# Altium project MSXII_SolarSenseMaster.PrjPcb
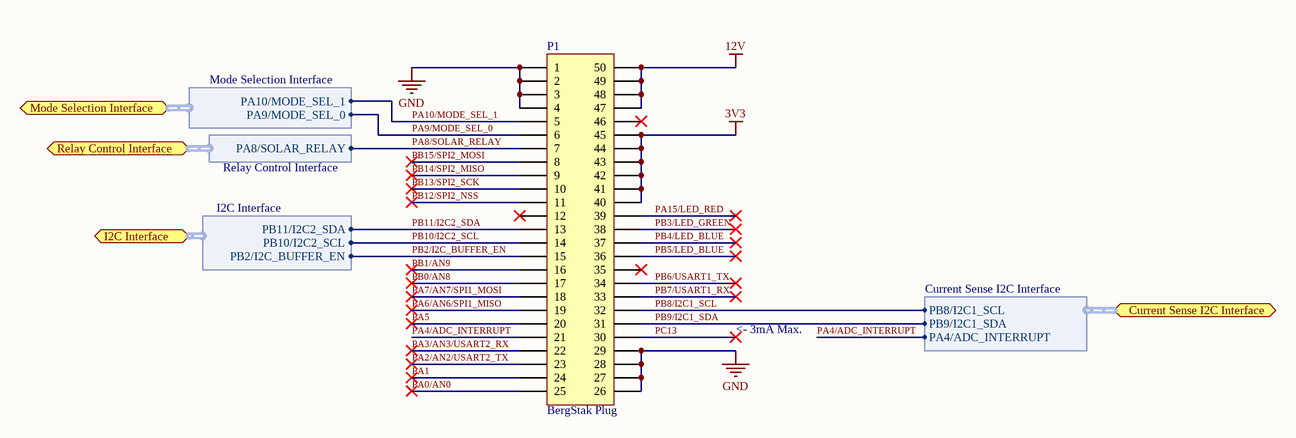
[diagram p0: Controller_Board_Interface.SchDoc]
ProjectAuthor: Peiliang Guo; ProjectRevision: 1.0
3 sheets, 62 parts. Net scope: flat (ports and power ports of the same name join across sheets).
Board file: SolarSenseMaster.PcbDoc
Sheets:
  Controller_Board_Interface.SchDoc
  SolarSenseMaster.SchDoc
  I2C_Interface.SchDoc

## Sheet Controller_Board_Interface.SchDoc
size Letter; Organization: Midnight Sun Solar Rayce Car Team; Address1: University of Waterloo; Address2: 200 University Ave W; Address3: Waterloo, ON, Canada; Address4: N2L 3E9; Website: www.uwmidsun.com

### Parts
P1  Series: BergStak Plug  [CONN, Bergstak 50 Pos Plug]  (hidden comment: CONN 50POS Bergstak Plug 0.02")

### Ports
Current Sense I2C Interface (harness Current Sense I2C Interface), I2C Interface (harness I2C Interface), Mode Selection Interface (harness Mode Selection Interface), Relay Control Interface (harness Relay Control Interface)

### Harnesses
I2C Interface: PB10/I2C2_SCL, PB11/I2C2_SDA, PB2/I2C_BUFFER_EN
Relay Control Interface: PA8/SOLAR_RELAY
Current Sense I2C Interface: PB8/I2C1_SCL, PB9/I2C1_SDA, PA4/ADC_INTERRUPT
Mode Selection Interface: PA9/MODE_SEL_0, PA10/MODE_SEL_1

### Nets
3V3: P1.40 P1.41 P1.42 P1.43 P1.44 P1.45
12V: P1.47 P1.48 P1.49 P1.50
GND: P1.1 P1.2 P1.3 P1.4 P1.26 P1.27 P1.28 P1.29
PA0/AN0: P1.25
PA1: P1.24
PA2/AN2/USART2_TX: P1.23
PA3/AN3/USART2_RX: P1.22
PA4/ADC_INTERRUPT: P1.21 ; port Current Sense I2C Interface.PA4/ADC_INTERRUPT
PA5: P1.20
PA6/AN6/SPI1_MISO: P1.19
PA7/AN7/SPI1_MOSI: P1.18
PA8/SOLAR_RELAY: P1.7 ; port Relay Control Interface.PA8/SOLAR_RELAY
PA9/MODE_SEL_0: P1.6 ; port Mode Selection Interface.PA9/MODE_SEL_0
PA10/MODE_SEL_1: P1.5 ; port Mode Selection Interface.PA10/MODE_SEL_1
PA15/LED_RED: P1.39
PB0/AN8: P1.17
PB1/AN9: P1.16
PB2/I2C_BUFFER_EN: P1.15 ; port I2C Interface.PB2/I2C_BUFFER_EN
PB3/LED_GREEN: P1.38
PB4/LED_BLUE: P1.37
PB5/LED_BLUE: P1.36
PB6/USART1_TX: P1.34
PB7/USART1_RX: P1.33
PB8/I2C1_SCL: P1.32 ; port Current Sense I2C Interface.PB8/I2C1_SCL
PB9/I2C1_SDA: P1.31 ; port Current Sense I2C Interface.PB9/I2C1_SDA
PB10/I2C2_SCL: P1.14 ; port I2C Interface.PB10/I2C2_SCL
PB11/I2C2_SDA: P1.13 ; port I2C Interface.PB11/I2C2_SDA
PB12/SPI2_NSS: P1.11
PB13/SPI2_SCK: P1.10
PB14/SPI2_MISO: P1.9
PB15/SPI2_MOSI: P1.8
PC13: P1.30

Not connected (* = marked no-connect by the designer): P1 12* 35* 46*

### Notes on the sheet
- <- 3mA Max.
- Project:
- Title:
- Size:
- Project Author
- Letter
- Revision:
- University of Waterloo
- 200 University Ave W
- Waterloo, ON, Canada
- N2L 3E9
- Date:
- Sheet
- of
- Website:

### Library data of the parts
P1 = CONN 50POS Bergstak Plug 0.02": 50 Position Connector Plug, Outer Shroud Contacts Surface Mount Gold; Manufacturer 1: Amphenol FCI; Manufacturer Part Number 1: 10132797-055100LF; Number of Positions: 50; Mated Stacking Heights: 5mm; Pitch: 0.020" (0.50mm); Supplier 1: Digi-Key; Supplier Part Number 1: 609-5226-1-ND; Packaging: Cut Tape (CT); Part Status: Active; Connector Type: Plug, Outer Shroud Contacts; Number of Rows: 2; Mounting Type: Surface Mount; Contact Finish: Gold; Contact Finish Thickness: 1µin (0.025µm); Height Above Board: 0.169" (4.30mm); ComponentLink1URL: http://portal.fciconnect.com/Comergent//fci/drawing/10132797.pdf; ComponentLink1Description: http://portal.fciconnect.com/Comergent//fci/drawing/10132797.pdf

## Sheet SolarSenseMaster.SchDoc
size Letter; Organization: Midnight Sun Solar Rayce Car Team; Address1: University of Waterloo; Address2: 200 University Ave W; Address3: Waterloo, ON, Canada; Address4: N2L 3E9; Website: www.uwmidsun.com
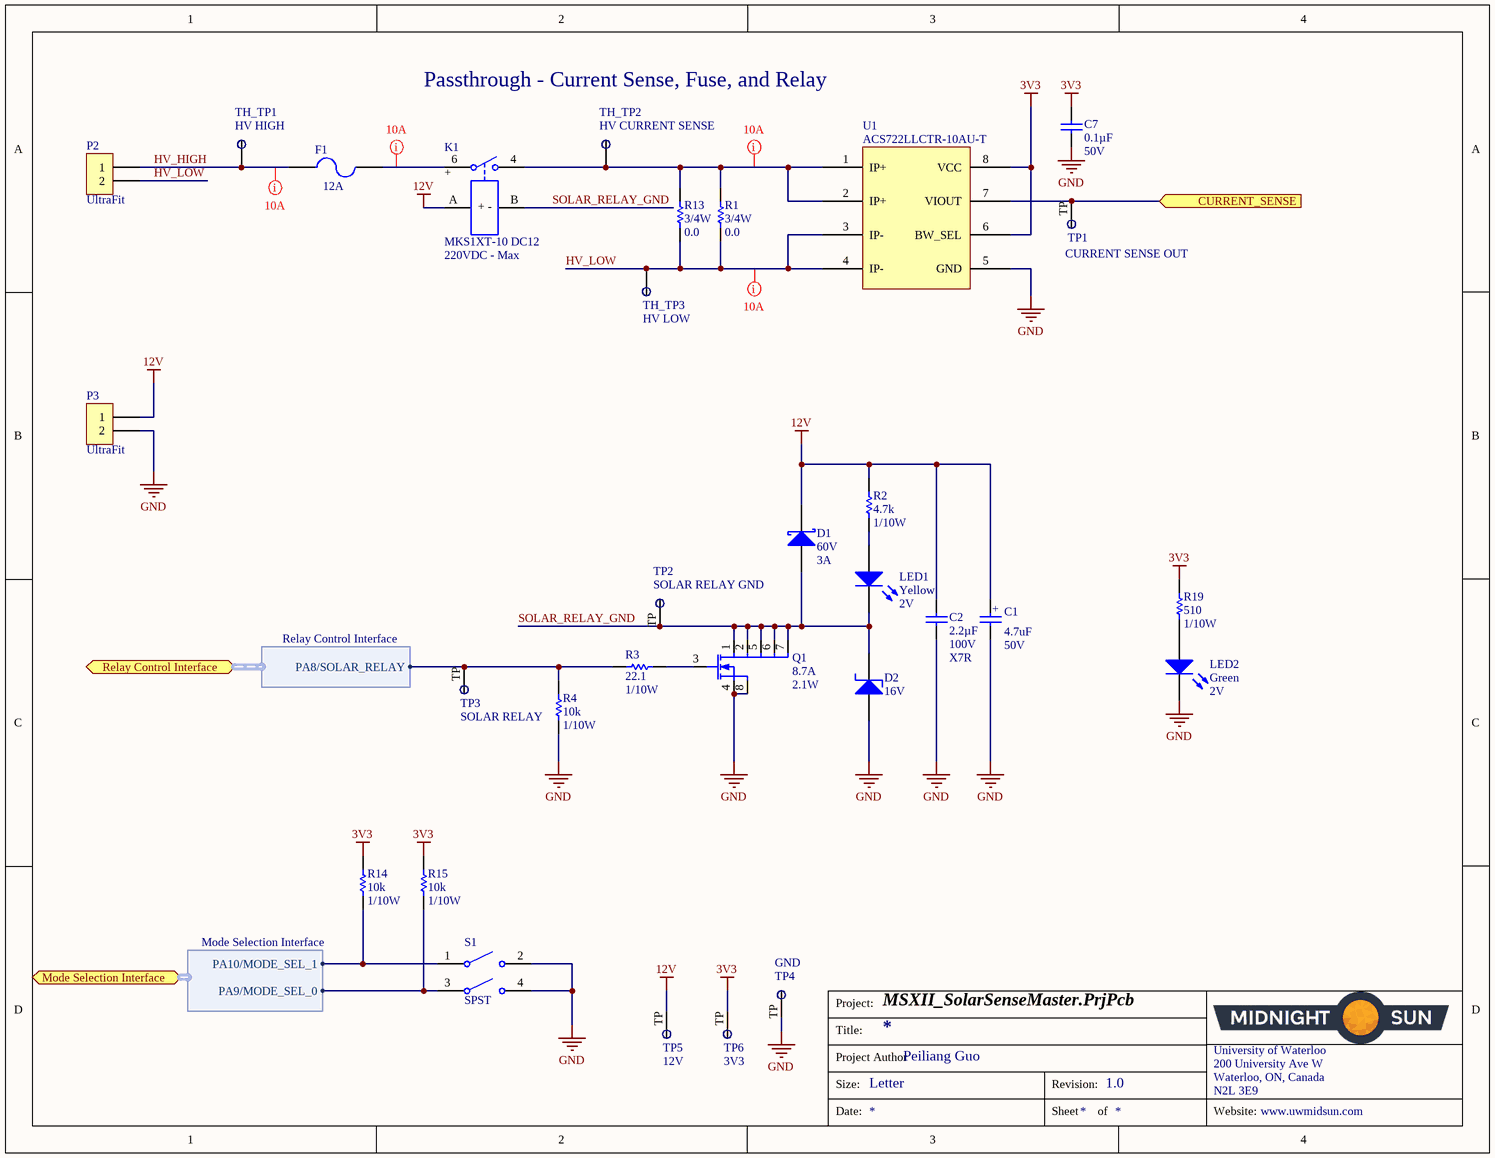
[diagram p1: SolarSenseMaster.SchDoc]

### Parts
C1  Capacitance: 4.7uF  Voltage Rating (DC): 50V  [CAP ALUM 6.3MM RADIAL SMD]  (hidden comment: EEE-1HA4R7NP)
C2  Capacitance: 2.2µF  Voltage: 100V  Temperature Coefficient: X7R  [CAP, 1206]  (hidden comment: CAP CER 2.2UF 100V ±20% X7R 1206)
C7  Capacitance: 0.1µF  Voltage: 50V  [CAP, 0603]  (hidden comment: CAP CER 0.1UF 50V 10% X7R 0603)
D1  Voltage - DC Reverse (Vr) (Max): 60V  Current - Average Rectified (Io): 3A  [Diode, SMA]  (hidden comment: DIODE SCHOTTKY 60V 3A SMA)
D2  Voltage - Zener (Nom): 16V  [DO-214AA Diode]  (hidden comment: DIODE ZENER 16V 5W DO-214AA (SMB))
F1  Current Rating: 12A  [FUSE CLIPS 1A3400-09-R]  (hidden comment: FUSE 12 A 600VAC/DC KLM-12)
K1  Manufacturer Part Number: MKS1XT-10 DC12  Switching Voltage: 220VDC - Max  [RELAY SOCKET P7M-06P]  (hidden comment: RELAY SPST 12V 10A)
LED1  Color: Yellow  Voltage - Forward (Vf) (Typ): 2V  [LED_0603]  (hidden comment: LED YELLOW CLEAR 2.1V 0603)
LED2  Color: Green  Voltage - Forward (Vf) (Typ): 2V  [LED_0603]  (hidden comment: LED GREEN CLEAR 2V 0603)
P2  Series: UltraFit  [CONN, 2POS ULTRA-FIT]  (hidden comment: CONN 2POS ULTRA-FIT 0.138")
P3  Series: UltraFit  [CONN, 2POS ULTRA-FIT]  (hidden comment: CONN 2POS ULTRA-FIT 0.138")
Q1  Current - Continuous Drain (Id) @ 25°C: 8.7A  Power Dissipation (Max): 2.1W  [MOSFET N-CH 30V 12A 2mmx2mm PQFN]  (hidden comment: MOSFET N-CH 30V 8.7A 2.1W 6-PQFN (2x2))
R1  Power (Watts): 3/4W  Resistance: 0.0  [RES 1206]  (hidden comment: RES 0.0 OHM 3/4W 1206)
R2  Resistance (Ohms): 4.7k  Power (Watts): 1/10W  [RES, 0603]  (hidden comment: RES 4.7K OHM 1% 1/10W 0603)
R3  Resistance: 22.1  Power: 1/10W  [RES, 0603]  (hidden comment: RES 22.1 OHM 1% 1/10W 0603)
R4  Resistance: 10k  Power: 1/10W  [RES, 0603]  (hidden comment: RES 10K OHM 1% 1/10W 0603)
R13  Power (Watts): 3/4W  Resistance: 0.0  [RES 1206]  (hidden comment: RES 0.0 OHM 3/4W 1206)
R14  Resistance: 10k  Power: 1/10W  [RES, 0603]  (hidden comment: RES 10K OHM 1% 1/10W 0603)
R15  Resistance: 10k  Power: 1/10W  [RES, 0603]  (hidden comment: RES 10K OHM 1% 1/10W 0603)
R19  Resistance: 510  Power: 1/10W  [RES, 0603]  (hidden comment: RES 510 OHM 5% 1/10W 0603)
S1  SPST  [SW SPST 2POS DIP 0.1A 20V]
TH_TP1  HV HIGH  [Thru Test Point]
TH_TP2  HV CURRENT SENSE  [Thru Test Point]
TH_TP3  HV LOW  [Thru Test Point]
TP1  CURRENT SENSE OUT  [Test Point]  (no BOM)
TP2  SOLAR RELAY GND  [Test Point]  (no BOM)
TP3  SOLAR RELAY  [Test Point]  (no BOM)
TP4  GND  [Test Point]  (no BOM)
TP5  12V  [Test Point]  (no BOM)
TP6  3V3  [Test Point]  (no BOM)
U1  Manufacturer Part Number: ACS722LLCTR-10AU-T  [SOIC8]  (hidden comment: IC CURRENT SENSOR HALL EFFECT 8-SOIC)

### Ports
CURRENT_SENSE (in), Mode Selection Interface (harness Mode Selection Interface), Relay Control Interface (harness Relay Control Interface)

### Harnesses
Relay Control Interface: PA8/SOLAR_RELAY
Mode Selection Interface: PA9/MODE_SEL_0, PA10/MODE_SEL_1

### Nets
3V3: C7.1 R14.1 R15.1 R19.1 TP6.TP U1.6(BW_SEL) U1.8(VCC)
12V: C1.1 C2.1 D1.2 K1.A(+) P3.1 R2.1 TP5.TP
GND: C1.2 C2.2 C7.2 D2.1(A) LED2.2(K) P3.2 Q1.4(S) Q1.8(S) R4.2 S1.2 S1.4 TP4.TP U1.5(GND)
HV_HIGH: F1.1 P2.1 TH_TP1.TH_TP
HV_LOW: P2.2 R1.2 R13.2 TH_TP3.TH_TP U1.3(IP-) U1.4(IP-)
PA8/SOLAR_RELAY: R3.1 R4.1 TP3.TP ; port Relay Control Interface.PA8/SOLAR_RELAY
PA9/MODE_SEL_0: R15.2 S1.3 ; port Mode Selection Interface.PA9/MODE_SEL_0
PA10/MODE_SEL_1: R14.2 S1.1 ; port Mode Selection Interface.PA10/MODE_SEL_1
SOLAR_RELAY_GND: D1.1 D2.2(K) K1.B(-) LED1.2(K) Q1.1(D) Q1.2(D) Q1.5(D) Q1.6(D) Q1.7(D) TP2.TP
NetF1_2: F1.2 K1.6
NetK1_4: K1.4 R1.1 R13.1 TH_TP2.TH_TP U1.1(IP+) U1.2(IP+)
NetLED1_1: LED1.1(A) R2.2
NetLED2_1: LED2.1(A) R19.2
NetQ1_3: Q1.3(G) R3.2
NetR18_1: TP1.TP U1.7(VIOUT) ; port CURRENT_SENSE

### Layout directives
net class 10A: HV_HIGH, HV_LOW, NetF1_2, NetK1_4

### Notes on the sheet
- Passthrough - Current Sense, Fuse, and Relay
- Project:
- Title:
- Size:
- Project Author
- Letter
- Revision:
- University of Waterloo
- 200 University Ave W
- Waterloo, ON, Canada
- N2L 3E9
- Date:
- Sheet
- of
- Website:
- (in symbol CAP ALUM 4.7UF 20% 50V SMD) +
- (in symbol RELAY SPST 12V 10A) + -

### Library data of the parts
C1 = CAP ALUM 4.7UF 20% 50V SMD: 4.7µF 50V Aluminum Electrolytic Capacitors Radial, Can - SMD 2000 Hrs @ 85°C; Manufacturer 1: Panasonic; Description 1: CAPACITOR ALUM ELEC, 4.7UF, 50V, 20%, SMD; Ripple Current: 31mA; Tolerance: 20%; Life (Hours): 2000Hour; Supplier 1: Digi-Key; Supplier Part Number 1: PCE4304CT-ND; Manufacturer Part Number 1: EEE-1HA4R7NP; Stock 1: 19771; Pricing 1: 1=0.43, 10=0.302, 100=0.1986, 500=0.1471 (USD); Mount: Surface Mount,PCB; Case/Package: Radial; Min Operating Temperature: -40°C; Max Operating Temperature: 85°C; Voltage Rating: 50V; Ripple Current (AC): 31mA; Packaging: Tape and Reel; Package Quantity: 1; Termination: SMD/SMT; Diameter: 6.3mm; Length: 5.5mm; Height: 5.4mm; Height - Seated (Max): 0.213inch; Width: 650um; Radiation Hardening: No; REACH SVHC: No SVHC; Lead Free: Lead Free; ComponentLink1URL: https://datasheet.ciiva.com/46374/aba0000ce2-46374373.pdf; ComponentLink1Description: https://datasheet.ciiva.com/46374/aba0000ce2-46374373.pdf; ComponentLink2URL: https://datasheet.ciiva.com/14600/70255710-14600343.pdf; ComponentLink2Description: https://datasheet.ciiva.com/14600/70255710-14600343.pdf; ComponentLink3URL: https://datasheet.ciiva.com/17536/aba0000ce2-17536647.pdf; ComponentLink3Description: https://datasheet.ciiva.com/17536/aba0000ce2-17536647.pdf; ComponentLink4URL: https://datasheet.ciiva.com/24027/aba0000ce2-40801-24027083.pdf; ComponentLink4Description: https://datasheet.ciiva.com/24027/aba0000ce2-40801-24027083.pdf; ComponentLink5URL: https://datasheet.ciiva.com/31414/aba0000ce2-31414684.pdf; ComponentLink5Description: https://datasheet.ciiva.com/31414/aba0000ce2-31414684.pdf; ComponentLink6URL: https://datasheet.ciiva.com/14606/70255710-14606079.pdf; ComponentLink6Description: https://datasheet.ciiva.com/14606/70255710-14606079.pdf
C2 = CAP CER 2.2UF 100V ±20% X7R 1206: 2.2µF ±20% 100V Ceramic Capacitor X7R 1206 (3216 Metric); Manufacturer 1: Murata Electronics North America; Manufacturer Part Number 1: GRM31CR72A225MA73L; Supplier 1: Digi-Key; Supplier Part Number 1: 490-12773-1-ND; Packaging: Cut Tape (CT); Part Status: Active; Operating Temperature: -55°C ~ 125°C; Ratings: -; Mounting Type: Surface Mount, MLCC; Package / Case: 1206 (3216 Metric); Size / Dimension: 0.126" L x 0.063" W (3.20mm x 1.60mm); Height - Seated (Max): -; Thickness (Max): 0.071" (1.80mm); Lead Spacing: -; Lead Style: -; ComponentLink1URL: http://www.murata.com/~/media/webrenewal/support/library/catalog/products/capacitor/mlcc/c02e.ashx; ComponentLink1Description: http://www.murata.com/~/media/webrenewal/support/library/catalog/products/capacitor/mlcc/c02e.ashx; Tolerance: ±20%
C7 = CAP CER 0.1UF 50V 10% X7R 0603: 0.10µF ±10% 50V Ceramic Capacitor X7R 0603 (1608 Metric); Manufacturer 1: AVX Corporation; Manufacturer Part Number 1: 06035C104KAT2A; Supplier 1: Digi-Key; Supplier Part Number 1: 478-5052-1-ND; Packaging: Cut Tape (CT); Part Status: Active; Operating Temperature: -55°C ~ 125°C; Ratings: -; Mounting Type: Surface Mount, MLCC; Package / Case: 0603 (1608 Metric); Size / Dimension: 0.063" L x 0.032" W (1.60mm x 0.81mm); Height - Seated (Max): -; Thickness (Max): 0.035" (0.90mm); Lead Spacing: -; Lead Style: -; ComponentLink1URL: http://datasheets.avx.com/X7RDielectric.pdf; ComponentLink1Description: http://datasheets.avx.com/X7RDielectric.pdf; Tolerance: ±10%; Temperature Coefficient: X7R
D1 = DIODE SCHOTTKY 60V 3A SMA: Diode Schottky 60V 3A Surface Mount SMA; Manufacturer 1: Diodes Incorporated; Manufacturer Part Number 1: B360A-13-F; Voltage - Forward (Vf) (Max) @ If: 700mV @ 3A; Speed: Fast Recovery =< 500ns, > 200mA (Io); Current - Reverse Leakage @ Vr: 500µA @ 60V; Capacitance @ Vr, F: 200pF @ 4V, 1MHz; Supplier 1: Digi-Key; Supplier Part Number 1: B360A-FDICT-ND; Packaging: Cut Tape (CT); Part Status: Active; Diode Type: Schottky; Mounting Type: Surface Mount; Package / Case: DO-214AC, SMA; Supplier Device Package: SMA; Operating Temperature - Junction: -55°C ~ 150°C; ComponentLink1URL: https://www.diodes.com/assets/Datasheets/ds30891.pdf; ComponentLink1Description: https://www.diodes.com/assets/Datasheets/ds30891.pdf
D2 = DIODE ZENER 16V 5W DO-214AA (SMB): Zener Diode 16V 5W ±5% Surface Mount DO-214AA (SMB); Manufacture: Micro Commercial Co; Manufacture Part Number: SMBJ5353B-TP; Impedence (Max): 2.5 Ohm; Voltage - Forward: 1.2V @ 1A; Power (Max): 5W; Supplier 1: Digi-Key; Supplier Part Number 1: SMBJ5353B-TPMSCT-ND
F1 = FUSE 12 A 600VAC/DC KLM-12: FUSE CRTRDGE 12A 600VAC/VDC 5AG; Manufacturer: Eaton; Fuse Type: Cartridge; Response Time: Fast; Approvals: CE, CSA, UL; Breaking Capacity @ Rated Voltage: 100kA AC, 50kA DC; Supplier 1: Digi-Key; Manufacturer Part Number: KLM-12; RoHS: RoHS Compliant; Category: Circuit Protection; Stock 1: 0; Pricing 1: 10=39.155 (CAD); Packaging: Bulk; Part Status: Active; Applications: Electrical, Industrial; Features: -; Class: -; Operating Temperature: -; Mounting Type: Holder; Package / Case: 5AG, 10mm x 38.1mm; Size / Dimension: 0.406" Dia x 1.500" L (10.30mm x 38.10mm); ComponentLink1URL: http://www.cooperindustries.com/content/dam/public/bussmann/Electrical/Resources/product-datasheets-a/Bus_Ele_DS_2020_KLM.pdf; ComponentLink1Description: http://www.cooperindustries.com/content/dam/public/bussmann/Electrical/Resources/product-datasheets-a/Bus_Ele_DS_2020_KLM.pdf; Supplier Part Number 1: KLM-12-ND
K1 = RELAY SPST 12V 10A: General Purpose Relay SPST-NO (1 Form A) 12VDC Coil Socketable; Manufacturer: Omron Automation and Safety; Coil Type: Non Latching; Turn On Voltage (Max): 9.6 VDC; Turn Off Voltage (Min): 1.8 VDC; Coil Power: 1.5 W; Supplier 1: Digi-Key; RoHS: RoHS Compliant; Category: Relays; Stock 1: 4; Pricing 1: 1=45.24, 10=42.981, 25=40.7192, 50=38.4572, 100=36.1949, 250=33.93272 (CAD); Packaging: Tray; Part Status: Active; Relay Type: General Purpose; Contact Form: SPST-NO (1 Form A); Features: -; Mounting Type: Socketable; Termination Style: Plug In; Operating Temperature: -40°C ~ 60°C; Contact Material: Silver Tin Indium (AgSnIn); ComponentLink1URL: http://www.ia.omron.com/data_pdf/cat/mk-s(x)_j175-e1_5_2_csm2141.pdf; ComponentLink1Description: http://www.ia.omron.com/data_pdf/cat/mk-s(x)_j175-e1_5_2_csm2141.pdf; Supplier Part Number 1: Z2956-ND; Coil Voltage: 12VDC
LED1 = LED YELLOW CLEAR 2.1V 0603: Yellow 590nm LED Indication - Discrete 2V 0603 (1608 Metric); Manufacturer: Wurth Electronics Inc.; Manufacturer Part Number: 150060YS75000; Lens Color: Colorless; Millicandela Rating: 120mcd; Lens Style/Size: Rectangle with Flat Top, 1.10mm x 0.70mm; Current - Test: 20mA; Viewing Angle: 140°; Wavelength - Peak: 595nm; Supplier 1: Digi-Key; RoHS: RoHS Compliant; Category: Optoelectronics; Stock 1: 10523; Pricing 1: 1=0.21, 100=0.1617, 500=0.13964 (CAD); Packaging: Cut Tape (CT); Part Status: Active; Lens Transparency: Clear; Mounting Type: Surface Mount; Wavelength - Dominant: 590nm; Features: -; Package / Case: 0603 (1608 Metric); Supplier Device Package: 0603; Size / Dimension: 1.60mm L x 0.80mm W; Height (Max): 0.80mm; ComponentLink1URL: http://katalog.we-online.de/led/datasheet/150060YS75000.pdf; ComponentLink1Description: http://katalog.we-online.de/led/datasheet/150060YS75000.pdf; Supplier Part Number 1: 732-4981-1-ND
LED2 = LED GREEN CLEAR 2V 0603: Green 572nm LED Indication - Discrete 2V 0603 (1608 Metric); Manufacturer: Wurth Electronics Inc.; Manufacturer Part Number: 150060VS75000; Lens Color: Colorless; Millicandela Rating: 40mcd; Lens Style/Size: Rectangle with Flat Top, 1.10mm x 0.70mm; Current - Test: 20mA; Viewing Angle: 140°; Wavelength - Dominant: 570nm; Supplier 1: Digi-Key; RoHS: RoHS Compliant; Category: Optoelectronics; Stock 1: 9408; Pricing 1: 1=0.21, 100=0.1617, 500=0.13964 (CAD); Packaging: Cut Tape (CT); Part Status: Active; Lens Transparency: Clear; Mounting Type: Surface Mount; Wavelength - Peak: 572nm; Features: -; Package / Case: 0603 (1608 Metric); Supplier Device Package: 0603; Size / Dimension: 1.60mm L x 0.80mm W; Height (Max): 0.80mm; ComponentLink1URL: http://katalog.we-online.de/led/datasheet/150060VS75000.pdf; ComponentLink1Description: http://katalog.we-online.de/led/datasheet/150060VS75000.pdf; Supplier Part Number 1: 732-4980-1-ND
P2 P3 = CONN 2POS ULTRA-FIT 0.138": 2 Positions Header, Shrouded Connector 0.138" (3.50mm) Through Hole Gold; Manufacturer 1: Molex, LLC; Manufacturer Part Number 1: 1722861302; Style: Board to Board or Cable; Shrouding: Shrouded - 4 Wall; Number of Positions: 2; Number of Positions Loaded: All; Contact Length - Post: 0.126" (3.20mm); Material Flammability Rating: UL94 V-0; Mated Stacking Heights: 26.99mm; Voltage: 400V; Supplier 1: Digi-Key; Supplier Part Number 1: WM11673-ND; Packaging: Tray; Part Status: Active; Connector Type: Header; Contact Type: Male Pin; Pitch - Mating: 0.138" (3.50mm); Number of Rows: 1; Row Spacing - Mating: -; Mounting Type: Through Hole; Termination: Kinked Pin, Solder; Fastening Type: Latch Holder; Contact Length - Mating: -; Overall Contact Length: -; Insulation Height: 0.465" (11.80mm); Contact Shape: Square; Contact Finish - Mating: Gold; Contact Finish Thickness - Mating: 30µin (0.76µm); Contact Finish - Post: Tin; Contact Material: Copper Alloy; Insulation Material: Liquid Crystal Polymer (LCP); Operating Temperature: -40°C ~ 120°C; Ingress Protection: -; Insulation Color: Black; Current Rating: -; Contact Finish Thickness - Post: 60µin (1.52µm); ComponentLink1URL: http://www.molex.com/pdm_docs/sd/1722861302_sd.pdf; ComponentLink1Description: http://www.molex.com/pdm_docs/sd/1722861302_sd.pdf
Q1 = MOSFET N-CH 30V 8.7A 2.1W 6-PQFN (2x2): Manufacturer 1: Infineon Technologies; Manufacturer Part Number 1: IRLHS6342TRPBF; Description 1: MOSFET N-CH 30V 8.7A 2X2 PQFN; FET Type: N-Channel; Drive Voltage (Max Rds On,  Min Rds On): 2.5V, 4.5V; Vgs(th) (Max) @ Id: 1.1V @ 10µA; Gate Charge (Qg) (Max) @ Vgs: 11nC @ 4.5V; Input Capacitance (Ciss) (Max) @ Vds: 1019pF @ 25V; Vgs (Max): ±12V; Rds On (Max) @ Id, Vgs: 15.5 mOhm @ 8.5A, 4.5V; Supplier 1: Digi-Key; Supplier Part Number 1: IRLHS6342TRPBFCT-ND; RoHS: RoHS Compliant; Category: Discrete Semiconductor Products; Stock 1: 9984; Pricing 1: 1=0.79, 10=0.685, 100=0.5118, 500=0.4022, 1000=0.31079 (CAD); Packaging: Cut Tape (CT); Part Status: Active; Technology: MOSFET (Metal Oxide); Drain to Source Voltage (Vdss): 30V; FET Feature: -; Operating Temperature: -55°C ~ 150°C (TJ); Mounting Type: Surface Mount; Supplier Device Package: 6-PQFN (2x2); Package / Case: 6-PowerVDFN; ComponentLink1URL: http://www.infineon.com/dgdl/irlhs6342pbf.pdf?fileId=5546d462533600a401535663b52625ad; ComponentLink1Description: http://www.infineon.com/dgdl/irlhs6342pbf.pdf?fileId=5546d462533600a401535663b52625ad
R1 R13 = RES 0.0 OHM 3/4W 1206: 0 Ohms Jumper 0.75W, 3/4W Chip Resistor 1206 (3216 Metric) Automotive AEC-Q200 Metal Foil; Manufacturer: Stackpole Electronics Inc.; Manufacturer Part Number: HCJ1206ZT0R00; Supplier 1: Digi-Key; RoHS: RoHS Compliant; Category: Resistors; Stock 1: 1029426; Pricing 1: 1=0.82, 10=0.583, 25=0.4552, 50=0.3852, 100=0.3034, 250=0.25676, 500=0.21006, 1000=0.16337 (CAD); Packaging: Cut Tape (CT); Part Status: Active; Tolerance: Jumper; Composition: Metal Foil; Features: Automotive AEC-Q200; Temperature Coefficient: -; Operating Temperature: -55°C ~ 155°C; Package / Case: 1206 (3216 Metric); Supplier Device Package: 1206; Size / Dimension: 0.122" L x 0.061" W (3.10mm x 1.55mm); Height - Seated (Max): 0.032" (0.80mm); Failure Rate: -; ComponentLink1URL: https://www.seielect.com/catalog/SEI-HCJ.pdf; ComponentLink1Description: https://www.seielect.com/catalog/SEI-HCJ.pdf; Supplier Part Number 1: HCJ1206ZT0R00CT-ND
R2 = RES 4.7K OHM 1% 1/10W 0603: 4.7k Ohm ±1% 0.1W, 1/10W Chip Resistor 0603 (1608 Metric) Moisture Resistant Thick Film; Manufacturer 1: Yageo; Manufacturer Part Number 1: RC0603FR-074K7L; Description 1: RES SMD 4.7K OHM 1% 1/10W 0603; Temperature Coefficient: ±100ppm/°C; Supplier 1: Digi-Key; Supplier Part Number 1: 311-4.70KHRCT-ND; RoHS: RoHS Compliant; Category: Resistors; Stock 1: 3487566; Pricing 1: 1=0.16, 10=0.022, 100=0.0089, 1000=0.00402, 2500=0.00349 (CAD); Packaging: Cut Tape (CT); Part Status: Active; Composition: Thick Film; Features: Moisture Resistant; Operating Temperature: -55°C ~ 155°C; Package / Case: 0603 (1608 Metric); Supplier Device Package: 0603; Size / Dimension: 0.063" L x 0.031" W (1.60mm x 0.80mm); Height - Seated (Max): 0.022" (0.55mm); Failure Rate: -; ComponentLink1URL: http://www.yageo.com/documents/recent/PYu-RC_Group_51_RoHS_L_7.pdf; ComponentLink1Description: http://www.yageo.com/documents/recent/PYu-RC_Group_51_RoHS_L_7.pdf; Tolerance: ±1%
R3 = RES 22.1 OHM 1% 1/10W 0603: 22.1 Ohm ±1% 0.1W, 1/10W Chip Resistor 0603 (1608 Metric) Moisture Resistant Thick Film; Manufacturer 1: Yageo; Manufacturer Part Number 1: RC0603FR-0722R1L; Temperature Coefficient: ±100ppm/°C; Supplier 1: Digi-Key; Supplier Part Number 1: 311-22.1HRCT-ND; Packaging: Cut Tape (CT); Part Status: Active; Composition: Thick Film; Operating Temperature: -55°C ~ 155°C; Package / Case: 0603 (1608 Metric); Supplier Device Package: 0603; Size / Dimension: 0.063" L x 0.031" W (1.60mm x 0.80mm); Height - Seated (Max): 0.022" (0.55mm); Failure Rate: -; ComponentLink1URL: http://www.yageo.com/documents/recent/PYu-RC_Group_51_RoHS_L_7.pdf; ComponentLink1Description: http://www.yageo.com/documents/recent/PYu-RC_Group_51_RoHS_L_7.pdf; Tolerance: ±1%
R4 R14 R15 = RES 10K OHM 1% 1/10W 0603: RES SMD 10K OHM 1% 1/10W 0603; Manufacturer 1: Yageo; Manufacturer Part Number 1: RC0603FR-0710KL; Temperature Coefficient: ±100ppm/°C; Supplier 1: Digi-Key; Supplier Part Number 1: 311-10.0KHRCT-ND; Packaging: Cut Tape (CT); Part Status: Active; Composition: Thick Film; Operating Temperature: -55°C ~ 155°C; Package / Case: 0603 (1608 Metric); Supplier Device Package: 0603; Size / Dimension: 0.063" L x 0.031" W (1.60mm x 0.80mm); Height - Seated (Max): 0.022" (0.55mm); Failure Rate: -; ComponentLink1URL: http://www.yageo.com/documents/recent/PYu-RC_Group_51_RoHS_L_7.pdf; ComponentLink1Description: http://www.yageo.com/documents/recent/PYu-RC_Group_51_RoHS_L_7.pdf; Tolerance: ±1%
R19 = RES 510 OHM 5% 1/10W 0603: RES SMD 510 OHM 5% 1/10W 0603; Manufacturer 1: Yageo; Manufacturer Part Number 1: RC0603JR-07510RL; Temperature Coefficient: ±100ppm/°C; Supplier 1: Digi-Key; Supplier Part Number 1: 311-510GRCT-ND; Packaging: Cut Tape (CT); Part Status: Active; Composition: Thick Film; Operating Temperature: -55°C ~ 155°C; Package / Case: 0603 (1608 Metric); Supplier Device Package: 0603; Size / Dimension: 0.063" L x 0.031" W (1.60mm x 0.80mm); Height - Seated (Max): 0.022" (0.55mm); Failure Rate: -; ComponentLink1URL: http://www.yageo.com/documents/recent/PYu-RC_Group_51_RoHS_L_7.pdf; ComponentLink1Description: http://www.yageo.com/documents/recent/PYu-RC_Group_51_RoHS_L_7.pdf; Tolerance: ±5%
S1 = SW SPST 2POS DIP 0.1A 20V: SWITCH SLIDE DIP SPST 100MA 20V; Manufacturer: CTS Electrocomponents; Manufacturer Part Number: 219-2MST; Voltage Rating: 20VDC; Actuator Type: Slide (Standard); Actuator Level: Raised; Pitch: 0.100" (2.54mm), Full; Washable: Yes; Electrical Life: 2,000 Cycles; Supplier 1: Digi-Key; RoHS: RoHS Compliant; Category: Switches; Stock 1: 444; Pricing 1: 1=0.84, 10=0.818, 25=0.7708, 50=0.7234, 100=0.6921, 250=0.66056, 500=0.59762, 1000=0.55044, 5000=0.44822 (CAD); Packaging: Tube; Part Status: Active; Circuit: SPST; Current Rating: 100mA; Contact Material: Beryllium Copper; Contact Finish: Gold; Height Above Board: 0.170" (4.33mm); Mounting Type: Surface Mount; Termination Style: Gull Wing; Features: Epoxy Sealed Terminals, Tape Seal; Operating Temperature: -55°C ~ 85°C; Body Material: -; Length: 0.258" (6.55mm); Mechanical Life: -; ComponentLink1URL: https://www.ctscorp.com/wp-content/uploads/219.pdf; ComponentLink1Description: https://www.ctscorp.com/wp-content/uploads/219.pdf; Supplier Part Number 1: CT2192MST-ND
TH_TP1-TH_TP3 = Thru Test Point
TP1-TP6 = Test Point
U1 = IC CURRENT SENSOR HALL EFFECT 8-SOIC: Current Sensor 10A 1 Channel Hall Effect, Open Loop Unidirectional 8-SOIC (0.154", 3.90mm Width); Manufacturer: Allegro MicroSystems, LLC; For Measuring: DC; Output: Ratiometric, Voltage; Sensitivity: 264mV/A; Frequency: DC ~ 80kHz; Linearity: ±1%; Accuracy: ±3%; Voltage - Supply: 3 V ~ 3.6 V; Response Time: 5µs; Current - Supply (Max): 12mA; Supplier 1: Digi-Key; RoHS: RoHS Compliant; Category: Sensors, Transducers; Stock 1: 5711; Pricing 1: 1=8.22, 5=7.25, 10=6.404, 25=5.1948, 50=4.5908, 100=4.4701, 500=3.74526, 1000=3.50362 (CAD); Packaging: Cut Tape (CT); Part Status: Active; Sensor Type: Hall Effect, Open Loop; Current - Sensing: 10A; Operating Temperature: -40°C ~ 150°C; Polarization: Unidirectional; Mounting Type: Surface Mount; Package / Case: 8-SOIC (0.154", 3.90mm Width); ComponentLink1URL: http://www.allegromicro.com/~/media/Files/Datasheets/ACS722-Datasheet.ashx; ComponentLink1Description: http://www.allegromicro.com/~/media/Files/Datasheets/ACS722-Datasheet.ashx; Supplier Part Number 1: 620-1636-1-ND

## Sheet I2C_Interface.SchDoc
size Letter; Organization: Midnight Sun Solar Rayce Car Team; Address1: University of Waterloo; Address2: 200 University Ave W; Address3: Waterloo, ON, Canada; Address4: N2L 3E9; Website: www.uwmidsun.com
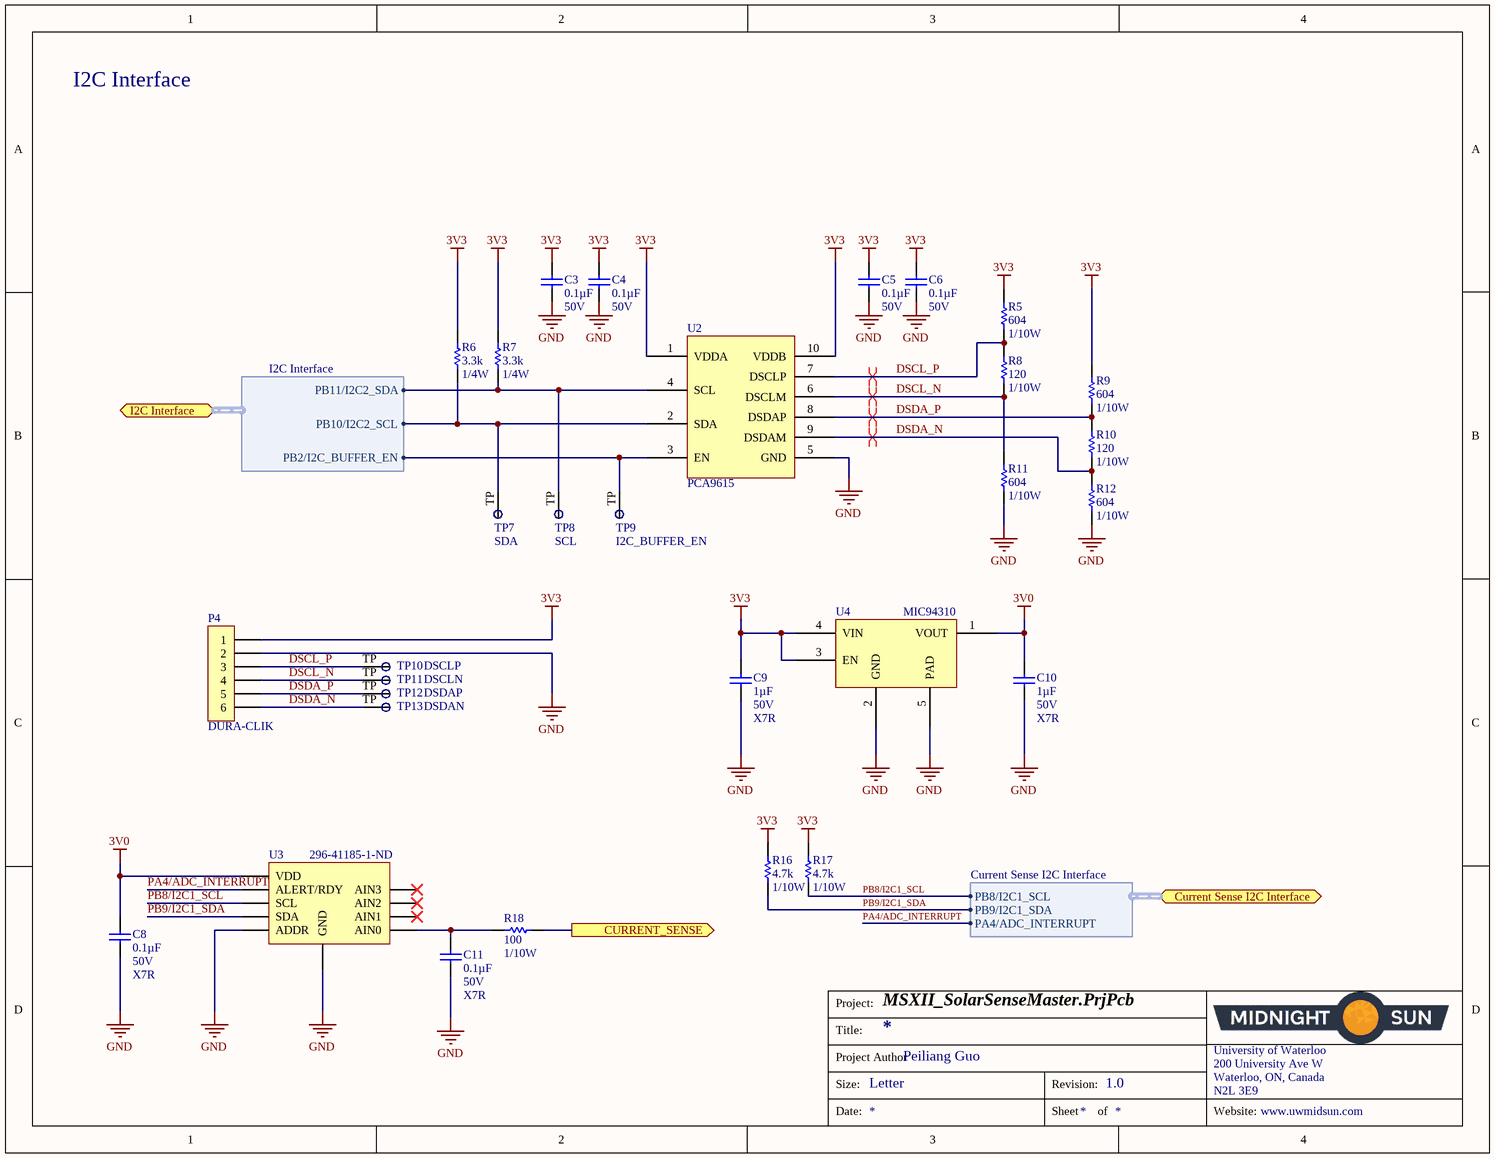
[diagram p2: I2C_Interface.SchDoc]

### Parts
C3  Capacitance: 0.1µF  Voltage: 50V  [CAP, 0603]  (hidden comment: CAP CER 0.1UF 50V 10% X7R 0603)
C4  Capacitance: 0.1µF  Voltage: 50V  [CAP, 0603]  (hidden comment: CAP CER 0.1UF 50V 10% X7R 0603)
C5  Capacitance: 0.1µF  Voltage: 50V  [CAP, 0603]  (hidden comment: CAP CER 0.1UF 50V 10% X7R 0603)
C6  Capacitance: 0.1µF  Voltage: 50V  [CAP, 0603]  (hidden comment: CAP CER 0.1UF 50V 10% X7R 0603)
C8  Capacitance: 0.1µF  Voltage: 50V  Temperature Coefficient: X7R  [CAP, 0603]  (hidden comment: CAP CER 0.1UF 50V 10% X7R 0603)
C9  Capacitance: 1µF  Voltage: 50V  Temperature Coefficient: X7R  [CAP, 0603]  (hidden comment: CAP CER 1UF 50V 10% X7R 0603)
C10  Capacitance: 1µF  Voltage: 50V  Temperature Coefficient: X7R  [CAP, 0603]  (hidden comment: CAP CER 1UF 50V 10% X7R 0603)
C11  Capacitance: 0.1µF  Voltage: 50V  Temperature Coefficient: X7R  [CAP, 0603]  (hidden comment: CAP CER 0.1UF 50V 10% X7R 0603)
P4  DURA-CLIK  [CONN, 6POS DURA-CLIK VERT]
R5  Resistance: 604  Power: 1/10W  [RES, 0603]  (hidden comment: RES 604 OHM 1% 1/10W 0603)
R6  Resistance: 3.3k  Power: 1/4W  [RES, 0603]  (hidden comment: RES 3.3K OHM 1% 1/4W 0603)
R7  Resistance: 3.3k  Power: 1/4W  [RES, 0603]  (hidden comment: RES 3.3K OHM 1% 1/4W 0603)
R8  Resistance: 120  Power: 1/10W  [RES, 0603]  (hidden comment: RES 120 OHM 1% 1/10W 0603)
R9  Resistance: 604  Power: 1/10W  [RES, 0603]  (hidden comment: RES 604 OHM 1% 1/10W 0603)
R10  Resistance: 120  Power: 1/10W  [RES, 0603]  (hidden comment: RES 120 OHM 1% 1/10W 0603)
R11  Resistance: 604  Power: 1/10W  [RES, 0603]  (hidden comment: RES 604 OHM 1% 1/10W 0603)
R12  Resistance: 604  Power: 1/10W  [RES, 0603]  (hidden comment: RES 604 OHM 1% 1/10W 0603)
R16  Resistance (Ohms): 4.7k  Power (Watts): 1/10W  [RES, 0603]  (hidden comment: RES 4.7K OHM 1% 1/10W 0603)
R17  Resistance (Ohms): 4.7k  Power (Watts): 1/10W  [RES, 0603]  (hidden comment: RES 4.7K OHM 1% 1/10W 0603)
R18  Resistance: 100  Power: 1/10W  [RES, 0603]  (hidden comment: RES 100 OHM 1% 1/10W 0603)
TP7  SDA  [Test Point]  (no BOM)
TP8  SCL  [Test Point]  (no BOM)
TP9  I2C_BUFFER_EN  [Test Point]  (no BOM)
TP10  DSCLP  [Test Point]  (no BOM)
TP11  DSCLN  [Test Point]  (no BOM)
TP12  DSDAP  [Test Point]  (no BOM)
TP13  DSDAN  [Test Point]  (no BOM)
U2  Base Part Number: PCA9615  [TSSOP50P490X110-10N]  (hidden comment: IC DIFFERENTIAL I2C BUFFER PCA9615)
U3  Supplier Part Number 1: 296-41185-1-ND  [IC ADC VSSOP10]  (hidden comment: Quad ADC)
U4  MIC94310  [IC REG LDO 3V 0.2A 4-TDFN]

### Ports
Current Sense I2C Interface (harness Current Sense I2C Interface), CURRENT_SENSE (out), I2C Interface (harness I2C Interface)

### Harnesses
I2C Interface: PB10/I2C2_SCL, PB11/I2C2_SDA, PB2/I2C_BUFFER_EN
Current Sense I2C Interface: PB8/I2C1_SCL, PB9/I2C1_SDA, PA4/ADC_INTERRUPT

### Nets
3V0: C8.1 C10.1 U3.8(VDD) U4.1(VOUT)
3V3: C3.1 C4.1 C5.1 C6.1 C9.1 P4.1 R5.1 R6.1 R7.1 R9.1 R16.1 R17.1 U2.1(VDDA) U2.10(VDDB) U4.3(EN) U4.4(VIN)
GND: C3.2 C4.2 C5.2 C6.2 C8.2 C9.2 C10.2 C11.2 P4.2 R11.2 R12.2 U2.5(GND) U3.1(ADDR) U3.3(GND) U4.2(GND) U4.5(PAD)
DSCL_N: P4.4 R8.2 R11.1 TP11.TP U2.6(DSCLM)
DSCL_P: P4.3 R5.2 R8.1 TP10.TP U2.7(DSCLP)
DSDA_N: P4.6 R10.2 R12.1 TP13.TP U2.9(DSDAM)
DSDA_P: P4.5 R9.2 R10.1 TP12.TP U2.8(DSDAP)
PA4/ADC_INTERRUPT: U3.2(ALERT/RDY) ; port Current Sense I2C Interface.PA4/ADC_INTERRUPT
PB2/I2C_BUFFER_EN: TP9.TP U2.3(EN) ; port I2C Interface.PB2/I2C_BUFFER_EN
PB8/I2C1_SCL: R17.2 U3.10(SCL) ; port Current Sense I2C Interface.PB8/I2C1_SCL
PB9/I2C1_SDA: R16.2 U3.9(SDA) ; port Current Sense I2C Interface.PB9/I2C1_SDA
PB10/I2C2_SCL: R6.2 TP7.TP U2.2(SDA) ; port I2C Interface.PB10/I2C2_SCL
PB11/I2C2_SDA: R7.2 TP8.TP U2.4(SCL) ; port I2C Interface.PB11/I2C2_SDA
NetC11_1: C11.1 R18.2 U3.4(AIN0)
NetR18_1: R18.1 ; port CURRENT_SENSE

Not connected (* = marked no-connect by the designer): U3 5(AIN1)* 6(AIN2)* 7(AIN3)*

### Layout directives
differential pair: DSCL_N, DSCL_P, DSDA_N, DSDA_P

### Notes on the sheet
- I2C Interface
- Project:
- Title:
- Size:
- Project Author
- Letter
- Revision:
- University of Waterloo
- 200 University Ave W
- Waterloo, ON, Canada
- N2L 3E9
- Date:
- Sheet
- of
- Website:

### Library data of the parts
C3-C6 C8 C11 = CAP CER 0.1UF 50V 10% X7R 0603: as C7 on sheet SolarSenseMaster; Supplier 1: Digi-Key; Supplier Part Number 1: 478-5052-1-ND; Packaging: Cut Tape (CT); Part Status: Active; Operating Temperature: -55°C ~ 125°C; Ratings: -; Mounting Type: Surface Mount, MLCC; Package / Case: 0603 (1608 Metric); Size / Dimension: 0.063" L x 0.032" W (1.60mm x 0.81mm); Height - Seated (Max): -; Thickness (Max): 0.035" (0.90mm); Lead Spacing: -; Lead Style: -; ComponentLink1URL: http://datasheets.avx.com/X7RDielectric.pdf; ComponentLink1Description: http://datasheets.avx.com/X7RDielectric.pdf; Tolerance: ±10%
  C3-C6: Temperature Coefficient: X7R
C9 C10 = CAP CER 1UF 50V 10% X7R 0603: 1µF ±10% 50V Ceramic Capacitor X7R 0603 (1608 Metric); Manufacturer 1: Taiyo Yuden; Manufacturer Part Number 1: UMK107AB7105KA-T; Supplier 1: Digi-Key; Supplier Part Number 1: 587-3247-1-ND; Packaging: Cut Tape (CT); Part Status: Active; Operating Temperature: -55°C ~ 125°C; Ratings: -; Mounting Type: Surface Mount, MLCC; Package / Case: 0603 (1608 Metric); Size / Dimension: 0.063" L x 0.031" W (1.60mm x 0.80mm); Height - Seated (Max): -; Thickness (Max): 0.037" (0.95mm); Lead Spacing: -; Lead Style: -; ComponentLink1URL: http://www.yuden.co.jp/productdata/catalog/en/mlcc_all_e.pdf; ComponentLink1Description: http://www.yuden.co.jp/productdata/catalog/en/mlcc_all_e.pdf; Tolerance: ±10%
P4 = CONN 6POS DURA-CLIK 0.079": 6 Positions Header, Shrouded Connector 0.079" (2.00mm) Surface Mount, Vertical Tin; Manufacturer: Molex; Manufacturer Part Number: 5600200820; Style: Board to Cable/Wire; Shrouding: Shrouded - 4 Wall; Number of Positions: 6; Number of Positions Loaded: All; Mated Stacking Heights: 9.3mm; Supplier 1: Digi-Key; Supplier Part Number 1: WM10866CT-ND; RoHS: RoHS Compliant; Category: Connectors, Interconnects; Stock 1: 3826; Pricing 1: 1=1.76, 10=1.542, 25=1.4512, 50=1.391, 100=1.3305, 250=1.20956 (CAD); Packaging: Cut Tape (CT); Part Status: Active; Connector Type: Header; Contact Type: Male Pin; Pitch - Mating: 0.079" (2.00mm); Number of Rows: 1; Row Spacing - Mating: -; Mounting Type: Surface Mount; Termination: Solder; Fastening Type: Latch Lock; Contact Length - Mating: -; Contact Length - Post: -; Overall Contact Length: -; Insulation Height: 0.315" (8.00mm); Contact Shape: Square; Contact Finish - Mating: Tin; Contact Finish Thickness - Mating: -; Contact Finish - Post: Tin; Contact Material: Copper Alloy; Insulation Material: Polyamide (PA), Nylon; Features: Solder Retention; Operating Temperature: -; Ingress Protection: -; Material Flammability Rating: -; Insulation Color: Natural; Current Rating: -; Voltage Rating: -; Contact Finish Thickness - Post: -; Applications: Automotive, Industrial; ComponentLink1URL: http://www.molex.com/pdm_docs/sd/5600200220_sd.pdf; ComponentLink1Description: http://www.molex.com/pdm_docs/sd/5600200220_sd.pdf
R5 R9 R11 R12 = RES 604 OHM 1% 1/10W 0603: RES SMD 604 OHM 1% 1/10W 0603; Manufacturer 1: Yageo; Manufacturer Part Number 1: RC0603FR-07604RL; Temperature Coefficient: ±100ppm/°C; Supplier 1: Digi-Key; Supplier Part Number 1: 311-604HRCT-ND; Packaging: Cut Tape (CT); Part Status: Active; Composition: Thick Film; Operating Temperature: -55°C ~ 155°C; Package / Case: 0603 (1608 Metric); Supplier Device Package: 0603; Size / Dimension: 0.063" L x 0.031" W (1.60mm x 0.80mm); Height - Seated (Max): 0.022" (0.55mm); Failure Rate: -; ComponentLink1URL: http://www.yageo.com/documents/recent/PYu-RC_Group_51_RoHS_L_7.pdf; ComponentLink1Description: http://www.yageo.com/documents/recent/PYu-RC_Group_51_RoHS_L_7.pdf; Tolerance: ±1%
R6 R7 = RES 3.3K OHM 1% 1/4W 0603: 3.3k Ohm ±1% 0.25W, 1/4W Chip Resistor 0603 (1608 Metric) Automotive AEC-Q200, Pulse Withstanding Thick Film; Manufacturer 1: Panasonic Electronic Components; Manufacturer Part Number 1: ERJ-PA3F3301V; Temperature Coefficient: ±100ppm/°C; Supplier 1: Digi-Key; Supplier Part Number 1: P3.3KBYCT-ND; Packaging: Cut Tape (CT); Part Status: Active; Composition: Thick Film; Operating Temperature: -55°C ~ 155°C; Package / Case: 0603 (1608 Metric); Supplier Device Package: 0603; Size / Dimension: 0.063" L x 0.031" W (1.60mm x 0.80mm); Height - Seated (Max): 0.022" (0.55mm); Failure Rate: -; ComponentLink1URL: https://industrial.panasonic.com/cdbs/www-data/pdf/RDO0000/AOA0000C291.pdf; ComponentLink1Description: https://industrial.panasonic.com/cdbs/www-data/pdf/RDO0000/AOA0000C291.pdf; Tolerance: ±1%
R8 R10 = RES 120 OHM 1% 1/10W 0603: RES SMD 120 OHM 1% 1/10W 0603; Manufacturer 1: Yageo; Manufacturer Part Number 1: RC0603FR-07120RL; Temperature Coefficient: ±100ppm/°C; Supplier 1: Digi-Key; Supplier Part Number 1: 311-120HRCT-ND; Packaging: Cut Tape (CT); Part Status: Active; Composition: Thick Film; Operating Temperature: -55°C ~ 155°C; Package / Case: 0603 (1608 Metric); Supplier Device Package: 0603; Size / Dimension: 0.063" L x 0.031" W (1.60mm x 0.80mm); Height - Seated (Max): 0.022" (0.55mm); Failure Rate: -; ComponentLink1URL: http://www.yageo.com/documents/recent/PYu-RC_Group_51_RoHS_L_7.pdf; ComponentLink1Description: http://www.yageo.com/documents/recent/PYu-RC_Group_51_RoHS_L_7.pdf; Tolerance: ±1%
R16 R17 = RES 4.7K OHM 1% 1/10W 0603: as R2 on sheet SolarSenseMaster; Supplier 1: Digi-Key; Supplier Part Number 1: 311-4.70KHRCT-ND; RoHS: RoHS Compliant; Category: Resistors; Stock 1: 3487566; Pricing 1: 1=0.16, 10=0.022, 100=0.0089, 1000=0.00402, 2500=0.00349 (CAD); Packaging: Cut Tape (CT); Part Status: Active; Composition: Thick Film; Features: Moisture Resistant; Operating Temperature: -55°C ~ 155°C; Package / Case: 0603 (1608 Metric); Supplier Device Package: 0603; Size / Dimension: 0.063" L x 0.031" W (1.60mm x 0.80mm); Height - Seated (Max): 0.022" (0.55mm); Failure Rate: -; ComponentLink1URL: http://www.yageo.com/documents/recent/PYu-RC_Group_51_RoHS_L_7.pdf; ComponentLink1Description: http://www.yageo.com/documents/recent/PYu-RC_Group_51_RoHS_L_7.pdf; Tolerance: ±1%
R18 = RES 100 OHM 1% 1/10W 0603: 100 Ohm ±1% 0.1W, 1/10W Chip Resistor 0603 (1608 Metric) Moisture Resistant Thick Film; Manufacturer 1: Yageo; Manufacturer Part Number 1: RC0603FR-07100RL; Temperature Coefficient: ±100ppm/°C; Supplier 1: Digi-Key; Supplier Part Number 1: 311-100HRCT-ND; Packaging: Cut Tape (CT); Part Status: Active; Composition: Thick Film; Operating Temperature: -55°C ~ 155°C; Package / Case: 0603 (1608 Metric); Supplier Device Package: 0603; Size / Dimension: 0.063" L x 0.031" W (1.60mm x 0.80mm); Height - Seated (Max): 0.022" (0.55mm); Failure Rate: -; ComponentLink1URL: http://www.yageo.com/documents/recent/PYu-RC_Group_51_RoHS_L_7.pdf; ComponentLink1Description: http://www.yageo.com/documents/recent/PYu-RC_Group_51_RoHS_L_7.pdf; Tolerance: ±1%
TP7-TP13 = Test Point
U2 = IC DIFFERENTIAL I2C BUFFER PCA9615: Buffer, ReDriver 2 Channel 400kHz 10-TSSOP; Manufacturer: NXP USA Inc.; Manufacturer Part Number: PCA9615DPJ; Input: 2-Wire Bus; Number of Channels: 2; Voltage - Supply: 2.3 V ~ 5.5 V; Current - Supply: 16µA; Supplier 1: Digi-Key; RoHS: RoHS Compliant; Category: Integrated Circuits (ICs); Stock 1: 7673; Pricing 1: 1=4.38, 10=3.93, 100=3.2205, 500=2.74156, 1000=2.31216 (CAD); Packaging: Cut Tape (CT); Part Status: Active; Type: Buffer, ReDriver; Applications: I²C; Output: 2-Wire Bus; Data Rate (Max): 400kHz; Delay Time: -; Signal Conditioning: -; Operating Temperature: -40°C ~ 85°C; Package / Case: 10-TFSOP, 10-MSOP (0.118", 3.00mm Width); Supplier Device Package: 10-TSSOP; ComponentLink1URL: http://www.nxp.com/documents/data_sheet/PCA9615.pdf; ComponentLink1Description: http://www.nxp.com/documents/data_sheet/PCA9615.pdf; Supplier Part Number 1: 568-11484-1-ND
U3 = IC ADC 12-BIT VSSOP-10: 12 Bit Analog to Digital Converter 4 Input 1 Sigma-Delta 10-VSSOP; Manufacturer: Texas Instruments; Manufacturer Part Number: ADS1015IDGSR; Number of Bits: 12; Sampling Rate (Per Second): 3.3k; Number of Inputs: 2, 4; Input Type: Differential, Single Ended; Data Interface: I²C; Configuration: MUX-PGA-ADC; Number of A/D Converters: 1; Reference Type: Internal; Voltage - Supply, Analog: 2 V ~ 5.5 V; Supplier 1: Digi-Key; RoHS: RoHS Compliant; Category: Integrated Circuits (ICs); Stock 1: 4084; Pricing 1: 1=4.25, 10=3.807, 100=3.1194, 500=2.65552, 1000=2.23959 (CAD); Packaging: Cut Tape (CT); Part Status: Active; Ratio - S/H:ADC: -; Architecture: Sigma-Delta; Voltage - Supply, Digital: 2 V ~ 5.5 V; Features: PGA, Selectable Address; Operating Temperature: -40°C ~ 125°C; Package / Case: 10-TFSOP, 10-MSOP (0.118", 3.00mm Width); Supplier Device Package: 10-VSSOP; ComponentLink1URL: http://www.ti.com/lit/ds/symlink/ads1013.pdf; ComponentLink1Description: http://www.ti.com/lit/ds/symlink/ads1013.pdf
U4 = IC REG LDO 3V 0.2A 4-TDFN: Manufacturer: Microchip Technology; Manufacturer Part Number: MIC94310-PYMT-TR; Regulator Topology: Positive Fixed; Voltage - Output: 3V; Current - Output: 200mA; Voltage - Dropout (Typical): 0.04V @ 200mA; Voltage - Input: Up to 3.6V; Current - Limit (Min): 250mA; Supplier 1: Digi-Key; RoHS: RoHS Compliant; Category: Integrated Circuits (ICs); Stock 1: 4802; Pricing 1: 1=0.45, 25=0.3708, 100=0.3386 (CAD); Packaging: Cut Tape (CT); Part Status: Active; Operating Temperature: -40°C ~ 125°C; Mounting Type: Surface Mount; Package / Case: 4-UFDFN Exposed Pad; Supplier Device Package: 4-TDFN (1.2x1.6); ComponentLink1URL: http://www.microchip.com/mymicrochip/filehandler.aspx?ddocname=en580409; ComponentLink1Description: http://www.microchip.com/mymicrochip/filehandler.aspx?ddocname=en580409; Supplier Part Number 1: 576-4761-1-ND

## Nets that join several sheets
3V3: Controller_Board_Interface (6 pins), SolarSenseMaster (7 pins), I2C_Interface (16 pins)
12V: Controller_Board_Interface (P1.47 P1.48 P1.49 P1.50), SolarSenseMaster (7 pins)
GND: Controller_Board_Interface (8 pins), SolarSenseMaster (13 pins), I2C_Interface (16 pins)
NetR18_1: SolarSenseMaster (TP1.TP U1.7), I2C_Interface (R18.1)
PA4/ADC_INTERRUPT: Controller_Board_Interface (P1.21), I2C_Interface (U3.2)
PA8/SOLAR_RELAY: Controller_Board_Interface (P1.7), SolarSenseMaster (R3.1 R4.1 TP3.TP)
PA9/MODE_SEL_0: Controller_Board_Interface (P1.6), SolarSenseMaster (R15.2 S1.3)
PA10/MODE_SEL_1: Controller_Board_Interface (P1.5), SolarSenseMaster (R14.2 S1.1)
PB2/I2C_BUFFER_EN: Controller_Board_Interface (P1.15), I2C_Interface (TP9.TP U2.3)
PB8/I2C1_SCL: Controller_Board_Interface (P1.32), I2C_Interface (R17.2 U3.10)
PB9/I2C1_SDA: Controller_Board_Interface (P1.31), I2C_Interface (R16.2 U3.9)
PB10/I2C2_SCL: Controller_Board_Interface (P1.14), I2C_Interface (R6.2 TP7.TP U2.2)
PB11/I2C2_SDA: Controller_Board_Interface (P1.13), I2C_Interface (R7.2 TP8.TP U2.4)